# EAGLE schematic modulo_promini (EAGLE 9.2.1)
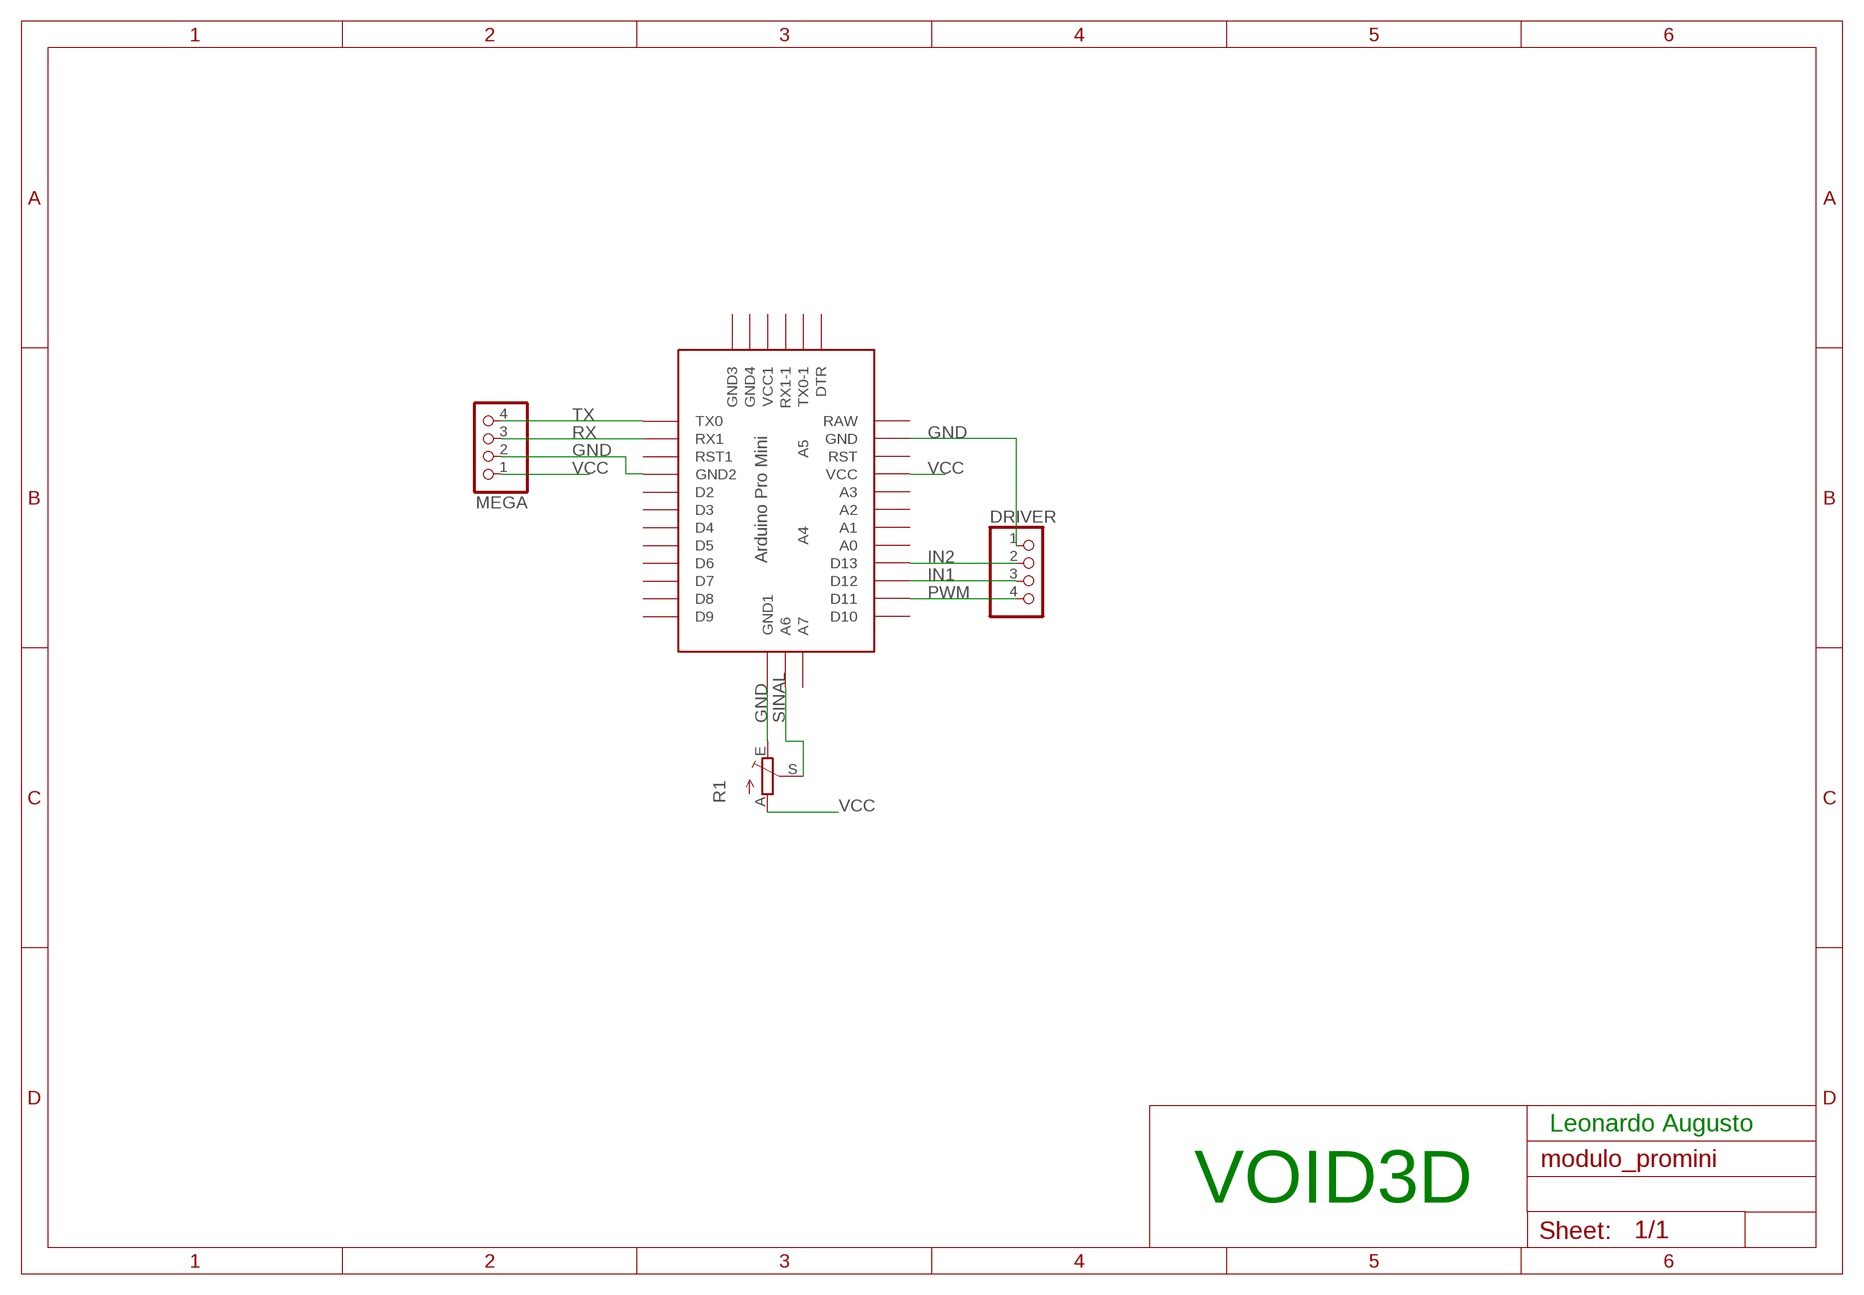
[diagram p0: schematic, sheet 1]

## Parts
DRIVER  PINHD-1X4  [1X04]
MEGA  PINHD-1X4  [1X04]
R1  TRIM_EU-CA9V  [CA9V]
U$1  ABK-PRO-MINI  [ABK-PRO-MINI]

## Nets
GND: DRIVER.1 MEGA.2 R1.E U$1.GND U$1.GND1(GND2) U$1.GND4(GND1)
IN1: DRIVER.3 U$1.D12
IN2: DRIVER.2 U$1.D13
PWM: DRIVER.4 U$1.D11
RX: MEGA.3 U$1.RX1
SINAL: R1.S U$1.A6
TX: MEGA.4 U$1.TX0
VCC: MEGA.1 R1.A U$1.VCC
Unconnected: U$1.A0 U$1.A1 U$1.A2 U$1.A3 U$1.A4 U$1.A5 U$1.A7 U$1.D2 U$1.D3 U$1.D4 U$1.D5 U$1.D6 U$1.D7 U$1.D8 U$1.D9 U$1.D10 U$1.DTR U$1.GND2(GND3) U$1.GND3(GND4) U$1.RAW U$1.RST U$1.RST1 U$1.RX1-1 U$1.TX0-1 U$1.VCC1

## Notes on the sheet
- Leonardo Augusto
- VOID3D

## Library data of the parts
DRIVER MEGA = pinhead:PINHD-1X4: PIN HEADER
R1 = pot:TRIM_EU-: POTENTIOMETER
U$1 = arduino:ABK-PRO-MINI: ABK Pro-Mini Arduino Clone